# EAGLE design esp8266_button (EAGLE 8.7.1)
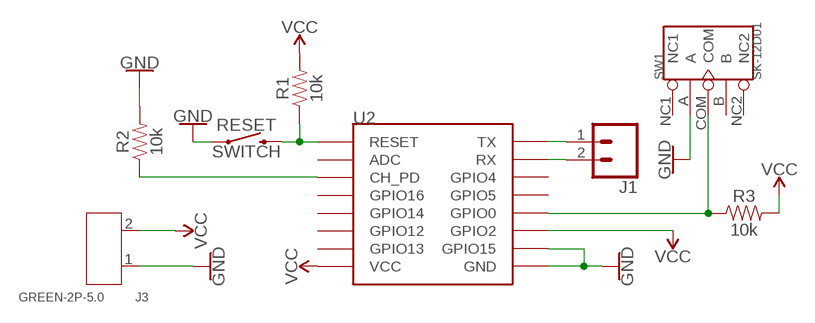
[diagram p0: schematic, sheet 1]

## Parts
J1  CONN_02  [1X02]
J3  GREEN-2P-5.0  SCREW-TERMINAL-GREEN(2P-5.0)  [H2-5.0-10.5X8.0MM]
R1  10k  10KOHM-HORIZ-1/4W-5%  [AXIAL-0.3]
R2  10k  10KOHM-HORIZ-1/4W-5%  [AXIAL-0.3]
R3  10k  10KOHM-HORIZ-1/4W-5%  [AXIAL-0.3]
RESET  SWITCH  MOMENTARY-SWITCH-SPST-PTH-6.0MM  [TACTILE_SWITCH_PTH_6.0MM]
SW1  SK-12D01  DIP-TOGGLE-SWITCH-ON-ON(3+2P-8.8X4.6MM)  [SW5-2.0-8.8X4.4X4.7MM-90D]
U2  ESP12SMD  [ESP12-SMD]

## Nets
GND: J3.1 R2.P$2 RESET.1 SW1.A U2.GND U2.GPIO15
N$1: R1.P$1 RESET.3 U2.RESET
N$2: R2.P$1 U2.CH_PD
N$3: J1.1 U2.TXD0(TX)
N$4: J1.2 U2.RXD0(RX)
N$5: R3.P$1 SW1.COM U2.GPIO0
VCC: J3.2 R1.P$2 R3.P$2 U2.GPIO2 U2.VCC
Unconnected: SW1.B SW1.NC1 SW1.NC2 U2.ADC U2.GPIO4 U2.GPIO5 U2.GPIO12 U2.GPIO13 U2.GPIO14 U2.GPIO16

## Library data of the parts
J1 = SparkFun-Connectors:CONN_02: Multi connection point. Often used as Generic Header-pin footprint for 0.1 inch spaced/style header connections On any of the 0.1 inch spaced packages, you can populate with these: Break Away Headers - Straight <https://www.sparkfun.com/products/116> (PRT-00116) Break Away Male Headers - Right Angle <https://www.sparkfun.com/products/553> (PRT-00553) Female Headers <https://www.sparkfun.com/products/115> (PRT-00115) Break Away Headers - Machine Pin <https://www.sparkfun.com/products/117> (PRT-00117) Break Away Female Headers - Swiss Machine Pin <https://www.sparkfun.com/products/743> (PRT-00743) For SCREWTERMINALS and SPRING TERMINALS visit here: Screw Terimnals on SparkFun.com <https://www.sparkfun.com/search/results?term=Screw+Terminals> (5mm/3.5mm/2.54mm spacing) This device is also useful as a general connection point to wire up your design to another part of your project. Our various solder wires solder well into these plated through hole pads. Hook-Up Wire - Assortment (Stranded, 22 AWG) <https://www.sparkfun.com/products/11375> (PRT-11375) Hook-Up Wire - Assortment (Solid Core, 22 AWG) <https://www.sparkfun.com/products/11367> (PRT-11367) View the entire wire category on our website here <https://www.sparkfun.com/categories/141> Special notes: Molex polarized connector foot print use with: PRT-08233 with associated crimp pins and housings. 2.54_SCREWTERM for use with PRT-10571. 3.5mm Screw Terminal footprints for PRT-08084 5mm Screw Terminal footprints for use with PRT-08432
J3 = Seeed-Connector:SCREW-TERMINAL-GREEN(2P-5.0): 320110031
R1-R3 = SparkFun-Resistors:10KOHM: 10kΩ resistor A resistor is a passive two-terminal electrical component that implements electrical resistance as a circuit element. Resistors act to reduce current flow, and, at the same time, act to lower voltage levels within circuits. - Wikipedia; PROD_ID: RES-09435
RESET = SparkFun-Switches:MOMENTARY-SWITCH-SPST: Momentary Switch (Pushbutton) - SPST Normally-open (NO) SPST momentary switches (buttons, pushbuttons). Variants PTH-12MM - 12mm square, through-hole Momentary Pushbutton Switch - 12mm Square <https://www.sparkfun.com/products/9190> (COM-09190) PTH-6.0MM, PTH-6.0MM-KIT - 6.0mm square, through-hole Mini Pushbutton Switch <https://www.sparkfun.com/products/97> (COM-00097) KIT package intended for soldering kit's - only one side of pads' copper is exposed. PTH-RIGHT-ANGLE-KIT - Right-angle, through-hole Right Angle Tactile Button <https://www.sparkfun.com/products/10791> - Used on SparkFun BigTime Watch Kit <https://www.sparkfun.com/products/11734> SMD-12MM - 12mm square, surface-mount Tactile Button - SMD (12mm) <https://www.sparkfun.com/products/12993> (COM-12993) Used on SparkFun PicoBoard <https://www.sparkfun.com/products/11888> SMD-4.5MM - 4.5mm Square Trackball Switch Used on SparkFun Blackberry Trackballer Breakout <https://www.sparkfun.com/products/13169> SMD-4.6MMX2.8MM - 4.60mm x 2.80mm, surface mount Used on SparkFun SAMD21 Mini Breakout <https://www.sparkfun.com/products/13664> SMD-5.2MM, SMD-5.2-REDUNDANT - 5.2mm square, surface-mount Mini Pushbutton Switch - SMD <https://www.sparkfun.com/products/8720> (COM-08720) Used on Arduino Pro Mini <https://www.sparkfun.com/products/11114> REDUNDANT package connects both switch circuits together SMD-6.0X3.5MM - 6.0 x 3.5mm, surface mount Momentary Reset Switch SMD <https://www.sparkfun.com/products/8229> (COM-08229) SMD-6.2MM-TALL - 6.2mm square, surface mount Tactile Button - SMD (6mm) <https://www.sparkfun.com/products/12992> Used on SparkFun Digital Sandbox <https://www.sparkfun.com/products/12651> SMD-RIGHT-ANGLE - Right-angle, surface mount Used on SparkFun Block for Intel® Edison - Arduino <https://www.sparkfun.com/products/13036>; PROD_ID: SWCH-08441; SF_SKU: COM-00097
SW1 = Seeed-OPL-Button:DIP-TOGGLE-SWITCH-ON-ON(3+2P-8.8X4.6MM): 311030008; MPN: SK-12D01
U2 = esp8266modules:ESP12: ESP8266 Wifi module 12

## Board
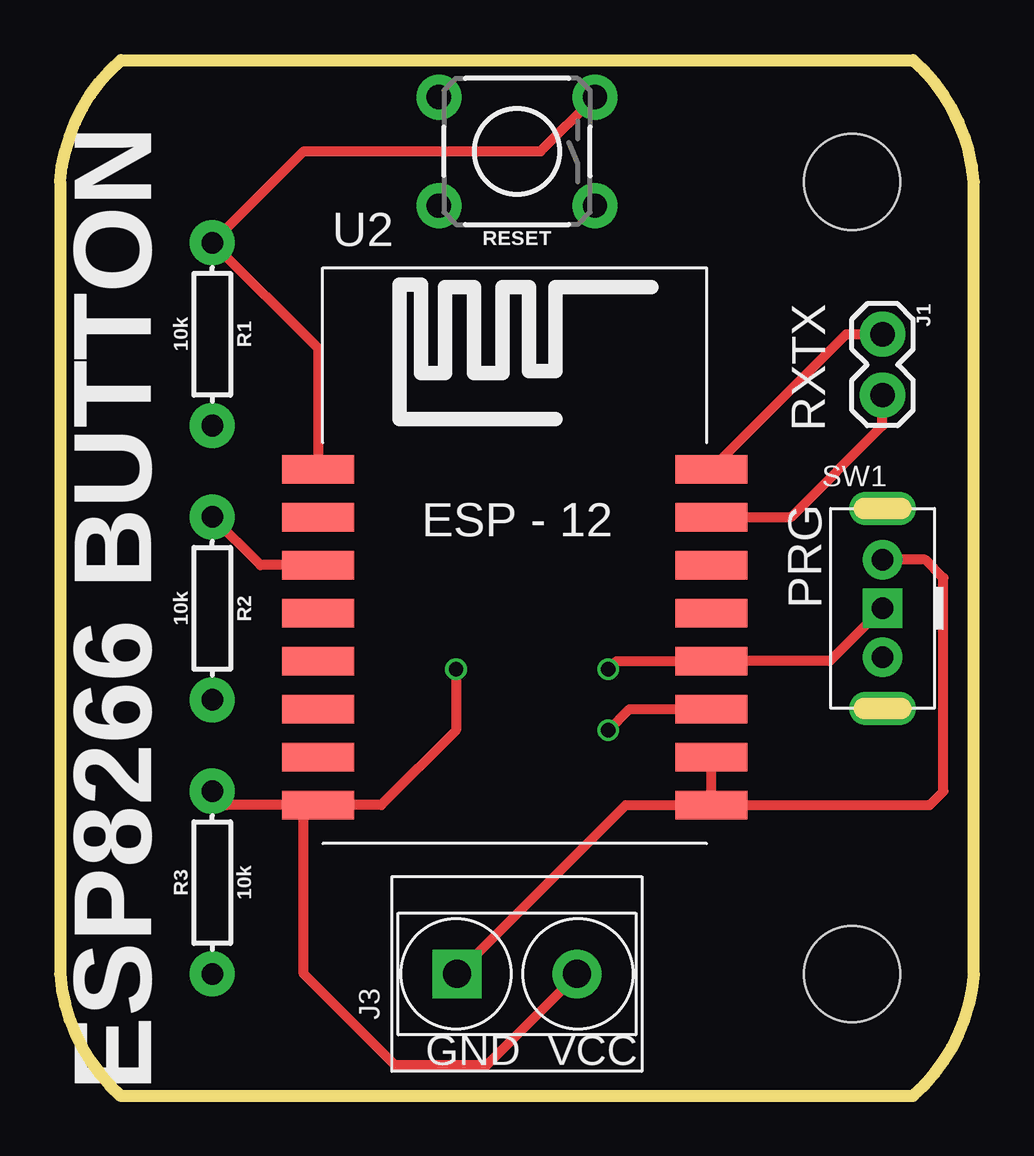
[diagram p1: board, top side]
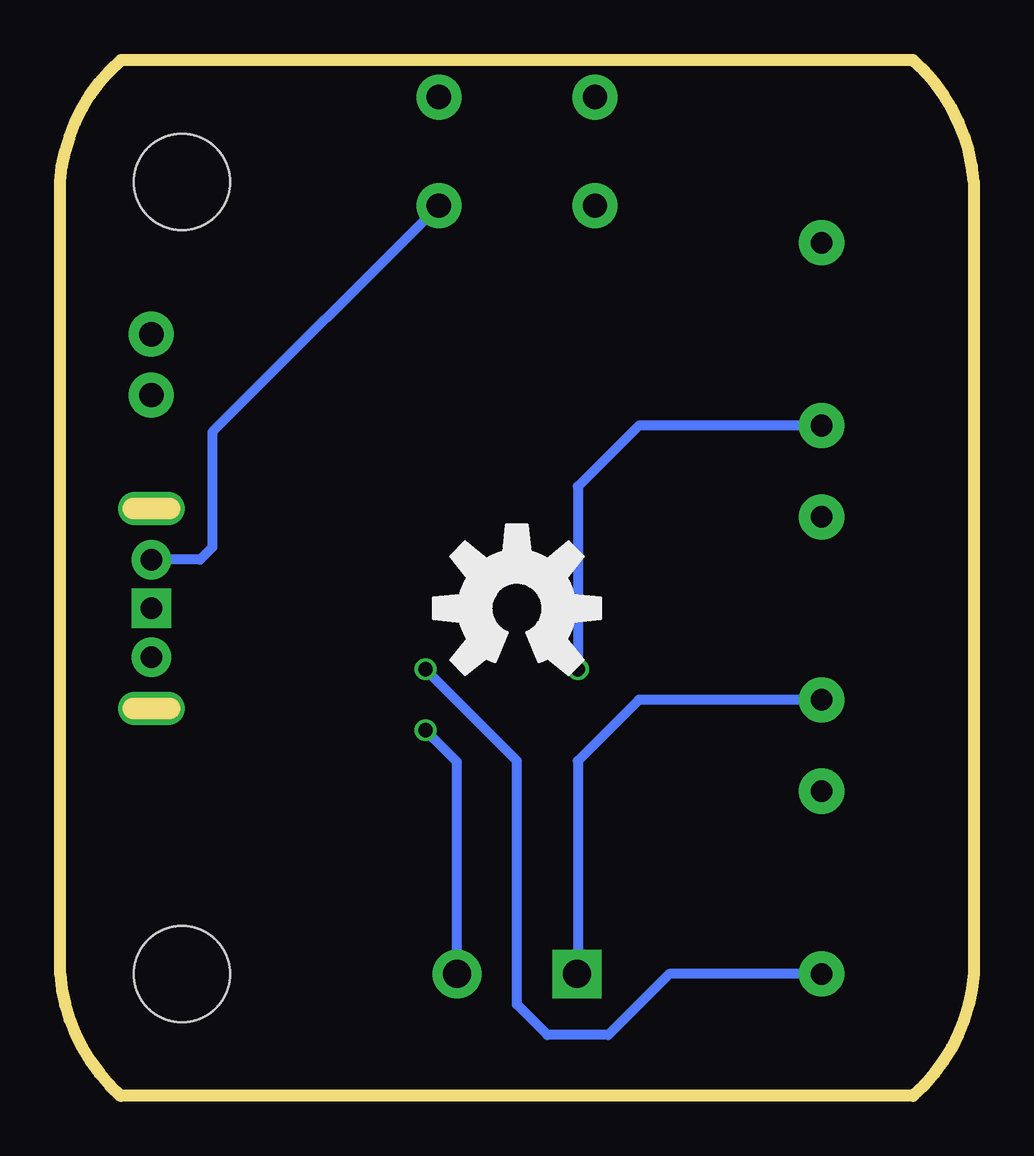
[diagram p2: board, bottom side, seen from below]

Size 38.1 x 43.18 mm. Coordinates in mm from the lower left corner, seen from the top.
Outline: 0,38.1 0,5.08 arc44 2.54,0 35.56,0 arc44 38.1,5.08 38.1,38.1 arc44 35.56,43.18 2.54,43.18 arc44 0,38.1
Copper layers (1*16): Top 0.035mm / dielectric 1.5mm / Bottom 0.035mm
Design rules "SeeedStudio_2layer_DRU_edited": minimum track width 7mil, minimum drill 15mil, track to track 6mil, track to pad 6mil, pad to pad 6mil, via to via 6mil, smd to smd 0mil, copper to edge 10mil, drill to drill 10mil, minimum pad ring 10mil, minimum via ring 6mil, stop-mask expansion 2mil, vias tented up to drill 100mil, thermal gap 10mil
Holes 4 mm at 33.02,5.08 33.02,38.1

### Footprints (pad centres in the part's own frame; a part is rotated, then mirrored left to right if it is on the bottom)
1X02 = drill 1.016 pad 1.88: 1 0,0; 2 2.54,0
H2-5.0-10.5X8.0MM = drill 1.168 pad 2.032 square: 1 0,2.5 | drill 1.168 pad 2.032: 2 0,-2.5
AXIAL-0.3 = drill 0.9 pad 1.88: P$1 -3.81,0; P$2 3.81,0
TACTILE_SWITCH_PTH_6.0MM = drill 1.016 pad 1.88: 1 -3.251,2.261; 2 3.251,2.261; 3 -3.251,-2.261; 4 3.251,-2.261
SW5-2.0-8.8X4.4X4.7MM-90D = drill 0.889 pad 1.651: A 0,2.032; B 0,-2.032 | drill 0.889 pad 1.651 square: COM 0,0 | drill 0.762 pad 1.397 long: NC1 0,4.166; NC2 0,-4.166
ESP12-SMD = smd 3 x 1.2: ADC -8.3,3.8; CH_PD -8.3,1.8; GND 8.1,-8.2; GPIO0 8.1,-2.2; GPIO2 8.1,-4.2; GPIO4 8.1,1.8; GPIO5 8.1,-0.2; GPIO12 -8.3,-4.2; GPIO13 -8.3,-6.2; GPIO14 -8.3,-2.2; GPIO15 8.1,-6.2; GPIO16 -8.3,-0.2; RESET -8.3,5.8; RXD0 8.1,3.8; TXD0 8.1,5.8; VCC -8.3,-8.2

### Placement (x,y rotation side)
J1  34.29,31.75 270 top
J3  19.05,5.08 90 top
R1  6.35,31.75 270 top
R2  6.35,20.32 270 top
R3  6.35,8.89 90 top
RESET  19.05,39.37 180 top
SW1  34.29,20.32 0 top
U2  19.05,20.32 0 top
U$1  [OSHW-LOGO-L]  19.05,20.32 0 bottom

### Tracks (layer width: path | path; a pad name or v marks a point on that pad's centre or on a via)
GND
  Top 0.406: J3.1 23.59,12.12 U2.GND | SW1.A 36.07,22.35 36.83,21.59 36.83,12.7 36.25,12.12 U2.GND | U2.GND U2.GPIO15
  Bottom 0.406: RESET.1 31.75,27.66 31.75,22.86 32.26,22.35 SW1.A | J3.1 16.51,5.12 16.51,13.97 13.97,16.51 R2.P$2
N$1
  Top 0.406: RESET.3 20.04,39.37 10.16,39.37 R1.P$1 10.75,31.16 U2.RESET
N$2
  Top 0.406: U2.CH_PD 8.36,22.12 R2.P$1
N$3
  Top 0.406: U2.TXD0 32.78,31.75 J1.1
N$4
  Top 0.406: U2.RXD0 30.48,24.13 34.29,27.94 J1.2
N$5  (via drill 0.6)
  Top 0.406: SW1.COM 32.09,18.12 27.94,18.12 U2.GPIO0 23.2,18.12 v22.86,17.78
  Bottom 0.406: R3.P$1 12.7,5.08 15.24,2.54 17.78,2.54 19.05,3.81 19.05,13.97 v22.86,17.78
VCC  (via drill 0.6)
  Top 0.406: 10.16,12.12 U2.VCC 13.39,12.12 16.51,15.24 v16.51,17.78 | 10.16,12.12 6.93,12.12 R3.P$2 | J3.2 21.55,5.04 17.78,1.27 13.97,1.27 10.16,5.08 10.16,12.12 | v22.86,15.24 23.74,16.12 U2.GPIO2
  Bottom 0.406: J3.2 21.55,13.93 v22.86,15.24 | R1.P$2 13.97,27.94 16.51,25.4 v16.51,17.78

### Text on the board
tPlace: TX | RX | ESP8266 BUTTON | PRG | GND | VCC